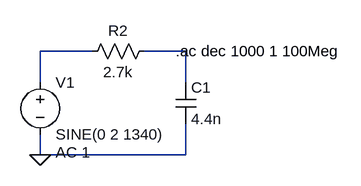
[diagram p0: schematic Rc_passo_basso.asc]
Rc_passo_basso.asc, the LTspice schematic file:
Version 4.1
SHEET 1 880 680
WIRE 208 -32 128 -32
WIRE 352 -32 288 -32
WIRE 128 16 128 -32
WIRE 352 16 352 -32
WIRE 128 128 128 96
WIRE 352 128 352 80
WIRE 352 128 128 128
FLAG 128 128 0
SYMBOL voltage 128 0 R0
WINDOW 123 24 124 Left 2
WINDOW 39 0 0 Left 0
SYMATTR InstName V1
SYMATTR Value SINE(0 2 1340)
SYMATTR Value2 AC 1
SYMBOL res 304 -48 R90
WINDOW 0 0 56 VBottom 2
WINDOW 3 32 56 VTop 2
SYMATTR InstName R2
SYMATTR Value 2.7k
SYMBOL cap 336 16 R0
SYMATTR InstName C1
SYMATTR Value 4.4n
TEXT 336 -32 Left 2 !.ac dec 1000 1 100Meg

The netlist it stands for:
* Rc_passo_basso.asc
V1 N001 0 SINE(0 2 1340) AC 1
R2 N002 N001 2.7k
C1 N002 0 4.4n
.ac dec 1000 1 100Meg
.backanno
.end